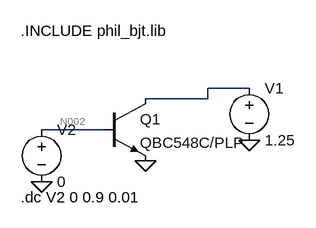
[diagram p0: schematic tbjphillips(ICvsVBE).asc]
tbjphillips(ICvsVBE).asc, the LTspice schematic file:
Version 4
SHEET 1 880 680
WIRE 352 112 288 112
WIRE 288 128 288 112
WIRE 288 128 192 128
WIRE 128 176 32 176
FLAG 192 224 0
FLAG 352 192 0
FLAG 32 256 0
SYMBOL npn 128 128 R0
SYMATTR InstName Q1
SYMATTR Value QBC548C/PLP
SYMBOL voltage 352 96 R0
WINDOW 123 0 0 Left 2
WINDOW 39 0 0 Left 2
SYMATTR InstName V1
SYMATTR Value 1.25
SYMBOL voltage 32 160 R0
WINDOW 123 0 0 Left 2
WINDOW 39 0 0 Left 2
SYMATTR InstName V2
SYMATTR Value 0
TEXT 0 24 Left 2 !.INCLUDE phil_bjt.lib
TEXT 0 280 Left 2 !.dc V2 0 0.9 0.01

The netlist it stands for:
* tbjphillips(ICvsVBE).asc
Q1 N001 N002 0 0 QBC548C/PLP
V1 N001 0 1.25
V2 N002 0 0
.model NPN NPN
.model PNP PNP
.lib standard.bjt
.INCLUDE phil_bjt.lib
.dc V2 0 0.9 0.01
.backanno
.end

* Results of the author's LTspice run, read from the files saved beside the schematic
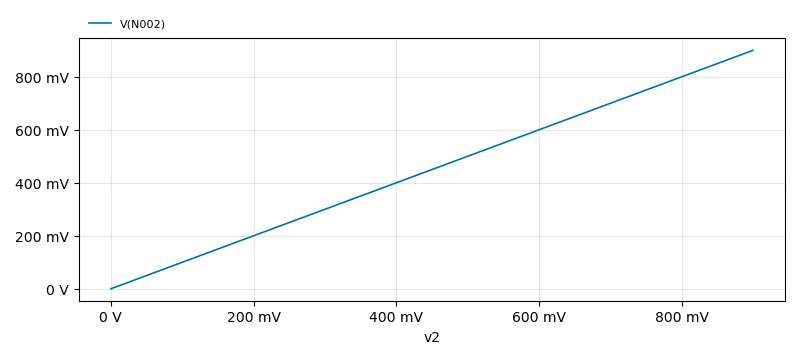
[diagram p1: DC transfer characteristic of tbjphillips(ICvsVBE).asc, plotted from the saved traces]
* DC transfer characteristic, 1 run:
*   V(N002): 0 V at v2=0 V, 900 mV at v2=900 mV, min 0 V, max 900 mV